# EAGLE schematic DataCollectorV1 v7 (EAGLE 9.7.0)
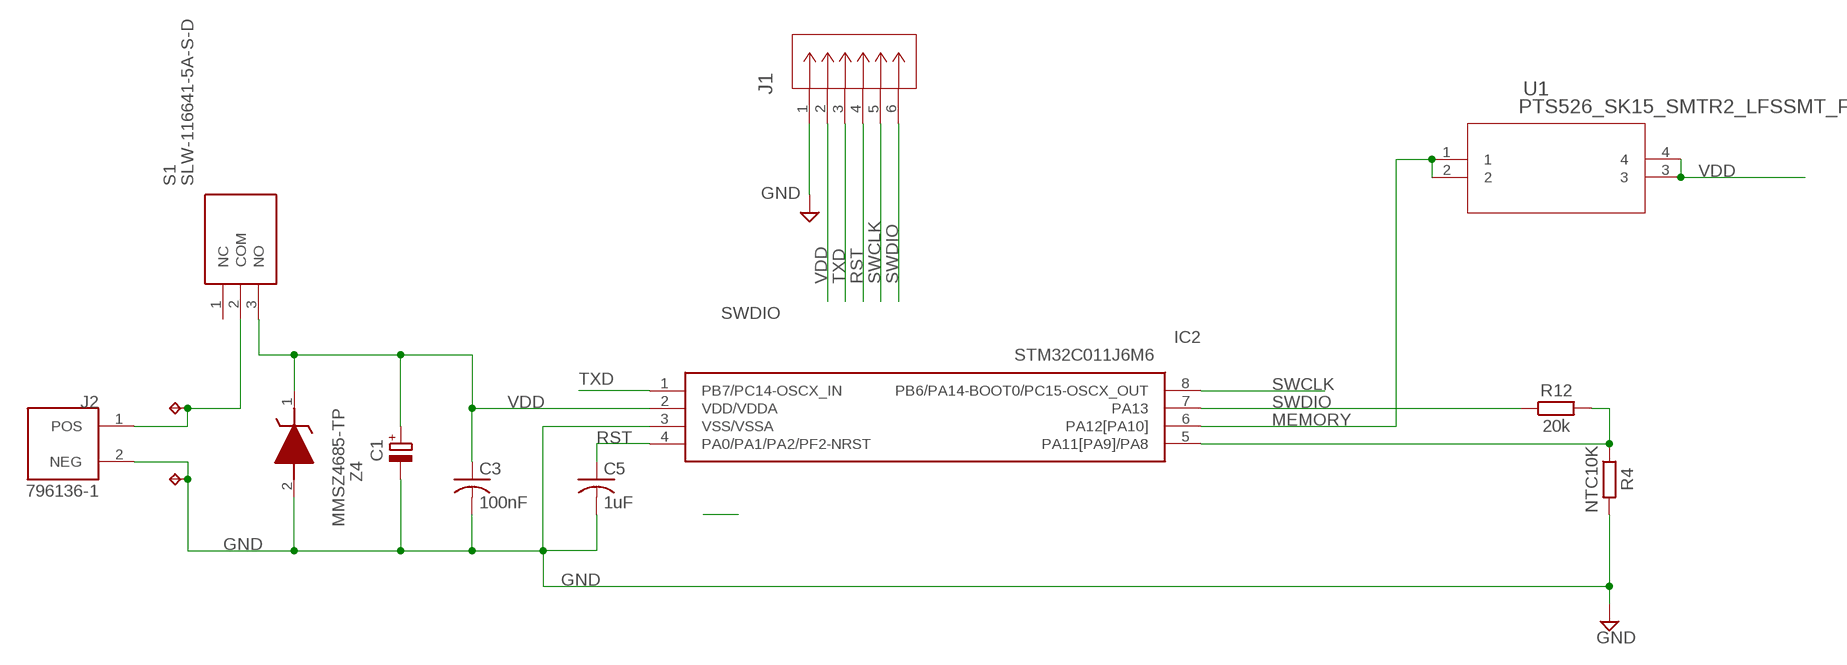
[diagram p0: schematic, sheet 1]

## Parts
BAT+  BAT+  TPPAD1-13  [P1-13]
BAT-  BAT-GND  TPPAD1-13  [P1-13]
C1  CAPACITOR-POL_ECAP-10.5MM  [CAPAE1030X1050N]
C3  100nF  C-US_CHIP-0805(2012-METRIC)  [CAPC2012X110]
C5  1uF  C-US_CHIP-0805(2012-METRIC)  [CAPC2012X110]
IC2  STM32C011J6M6  [SOIC127P600X175-8N]
J1  530470610CON_530470610_MOL  [CON_530470610_MOL]
J2  796136-1  [796136-1]
R4  NTC10K  R_CHIP-0805(2012-METRIC)  [RESC2012X65]
R12  20k  R_CHIP-0805(2012-METRIC)  [RESC2012X65]
S1  SLW-116641-5A-S-D  [SLW1166415ASD]
U1  PTS526_SK15_SMTR2_LFSSMT_FS  [SMT_FS]
Z4  MMSZ4685-TP  [SOD3716X135N]

## Nets
GND: BAT-.TP C1.2(-) C3.2 C5.2 IC2.3(VSS/VSSA) J1.1 J2.2(NEG) R4.2 Z4.2(A)
MEMORY: IC2.6(PA12[PA10]) U1.1 U1.2
N$1: BAT+.TP J2.1(POS) S1.2(COM)
NTC: IC2.5(PA11[PA9]/PA8) R4.1 R12.2
RST: C5.1 IC2.4(PA0/PA1/PA2/PF2-NRST) J1.4
SWCLK: IC2.8(PB6/PA14-BOOT0/PC15-OSCX_OUT) J1.5
SWDIO: IC2.7(PA13) J1.6 R12.1
TXD: IC2.1(PB7/PC14-OSCX_IN) J1.3
VDD: C1.1(+) C3.1 IC2.2(VDD/VDDA) J1.2 S1.3(NO) U1.3 U1.4 Z4.1(K)
Unconnected: S1.1(NC)

## Library data of the parts
BAT+ BAT- = testpad:TP: Test pad
C1 = Tinkercad:CAPACITOR-POL: Capacitor Polarised - Generic; CATEGORY: Capacitor
C3 C5 = Capacitor:C-US: Capacitor - ANSI; CATEGORY: Capacitor
IC2 = STM32C011J6M6:STM32C011J6M6: Mainstream Arm Cortex-M0+ MCU with 32 Kbytes of Flash memory, 6 Kbytes RAM, 48 MHz CPU, 2x USART, timers, ADC, comm. I/F, 2-3.6V Source: Datasheet <https://www.st.com/resource/en/datasheet/stm32c011d6.pdf>; DESCRIPTION: Mainstream Arm Cortex-M0+ MCU with 32 Kbytes of Flash memory, 6 Kbytes RAM, 48 MHz CPU, 2x USART, timers, ADC, comm. I/F, 2-3.6V; HEIGHT: 1.75mm; MANUFACTURER_NAME: STMicroelectronics; MANUFACTURER_PART_NUMBER: STM32C011J6M6; MOUSER_PART_NUMBER: 511-STM32C011J6M6; MOUSER_PRICE-STOCK: https://www.mouser.co.uk/ProductDetail/STMicroelectronics/STM32C011J6M6?qs=IPgv5n7u5Qas2LaNYHG%2FbQ%3D%3D
J1 = Library:530470610; COPYRIGHT: Copyright (C) 2024 Ultra Librarian. All rights reserved.; MANUFACTURER_PART_NUMBER: 530470610; MFR_NAME: Molex Connector Corporation
J2 = Connectors:796136-1: BATTERY HOLDER COIN 20MM SMD Manufacturer's datasheet <https://www.te.com/commerce/DocumentDelivery/DDEController?Action=srchrtrv&DocNm=796136&DocType=Customer+Drawing&DocLang=English>; CREATED_BY: PCBLayout.com; DIGIKEY_PART_NUMBER: A99327CT-ND; MANUFACTURER: TE Connectivity AMP Connectors; MPN: 796136-1
R4 R12 = Resistor:R: Resistor Fixed - Generic; CATEGORY: Resistor; SUB-CATEGORY: Fixed
S1 = SLW-116641-5A-S-D:SLW-116641-5A-S-D: 11.6 x 6 x 4.1 mm, 5 mm Raised Slide Actuator, Through Hole, Slide Switch Source: Datasheet <https://www.sameskydevices.com/product/resource/supplyframepdf/slw-116641-5a-s-d.pdf>; ARROW_PART_NUMBER: SLW-116641-5A-S-D; ARROW_PRICE-STOCK: https://www.arrow.com/en/products/slw-116641-5a-s-d/cui-devices?utm_currency=USD&region=nac; DESCRIPTION: 11.6 x 6 x 4.1 mm, 5 mm Raised Slide Actuator, Through Hole, Slide Switch; HEIGHT: 11.3mm; MANUFACTURER_NAME: Same Sky; MANUFACTURER_PART_NUMBER: SLW-116641-5A-S-D; MOUSER_PART_NUMBER: 179-SLW1166415ASD; MOUSER_PRICE-STOCK: https://www.mouser.co.uk/ProductDetail/Same-Sky/SLW-116641-5A-S-D?qs=IKkN%2F947nfBZSdW8n5Vqgw%3D%3D
U1 = 2023-10-17_07-06-43_Library:PTS526_SK15_SMTR2_LFS; COPYRIGHT: Copyright (C) 2023 Ultra Librarian. All rights reserved.; MANUFACTURER_PART_NUMBER: PTS526 SK15 SMTR2 LFS; MFR_NAME: C&K Components
Z4 = MMSZ4685-TP:MMSZ4685-TP: Zener Diodes Source: Datasheet <https://www.mccsemi.com/pdf/Products/MMSZ4678-MMSZ4716(SOD-123).pdf>; DESCRIPTION: Zener Diodes; HEIGHT: 1.35mm; MANUFACTURER_NAME: MCC; MANUFACTURER_PART_NUMBER: MMSZ4685-TP; MOUSER_PART_NUMBER: 833-MMSZ4685-TP; MOUSER_PRICE-STOCK: https://www.mouser.co.uk/ProductDetail/Micro-Commercial-Components-MCC/MMSZ4685-TP?qs=SdqRYZZ9IxCNMMu0fTwT6A%3D%3D